# EAGLE design pc_max30003_brk_v2.0 (EAGLE 6.6.0)
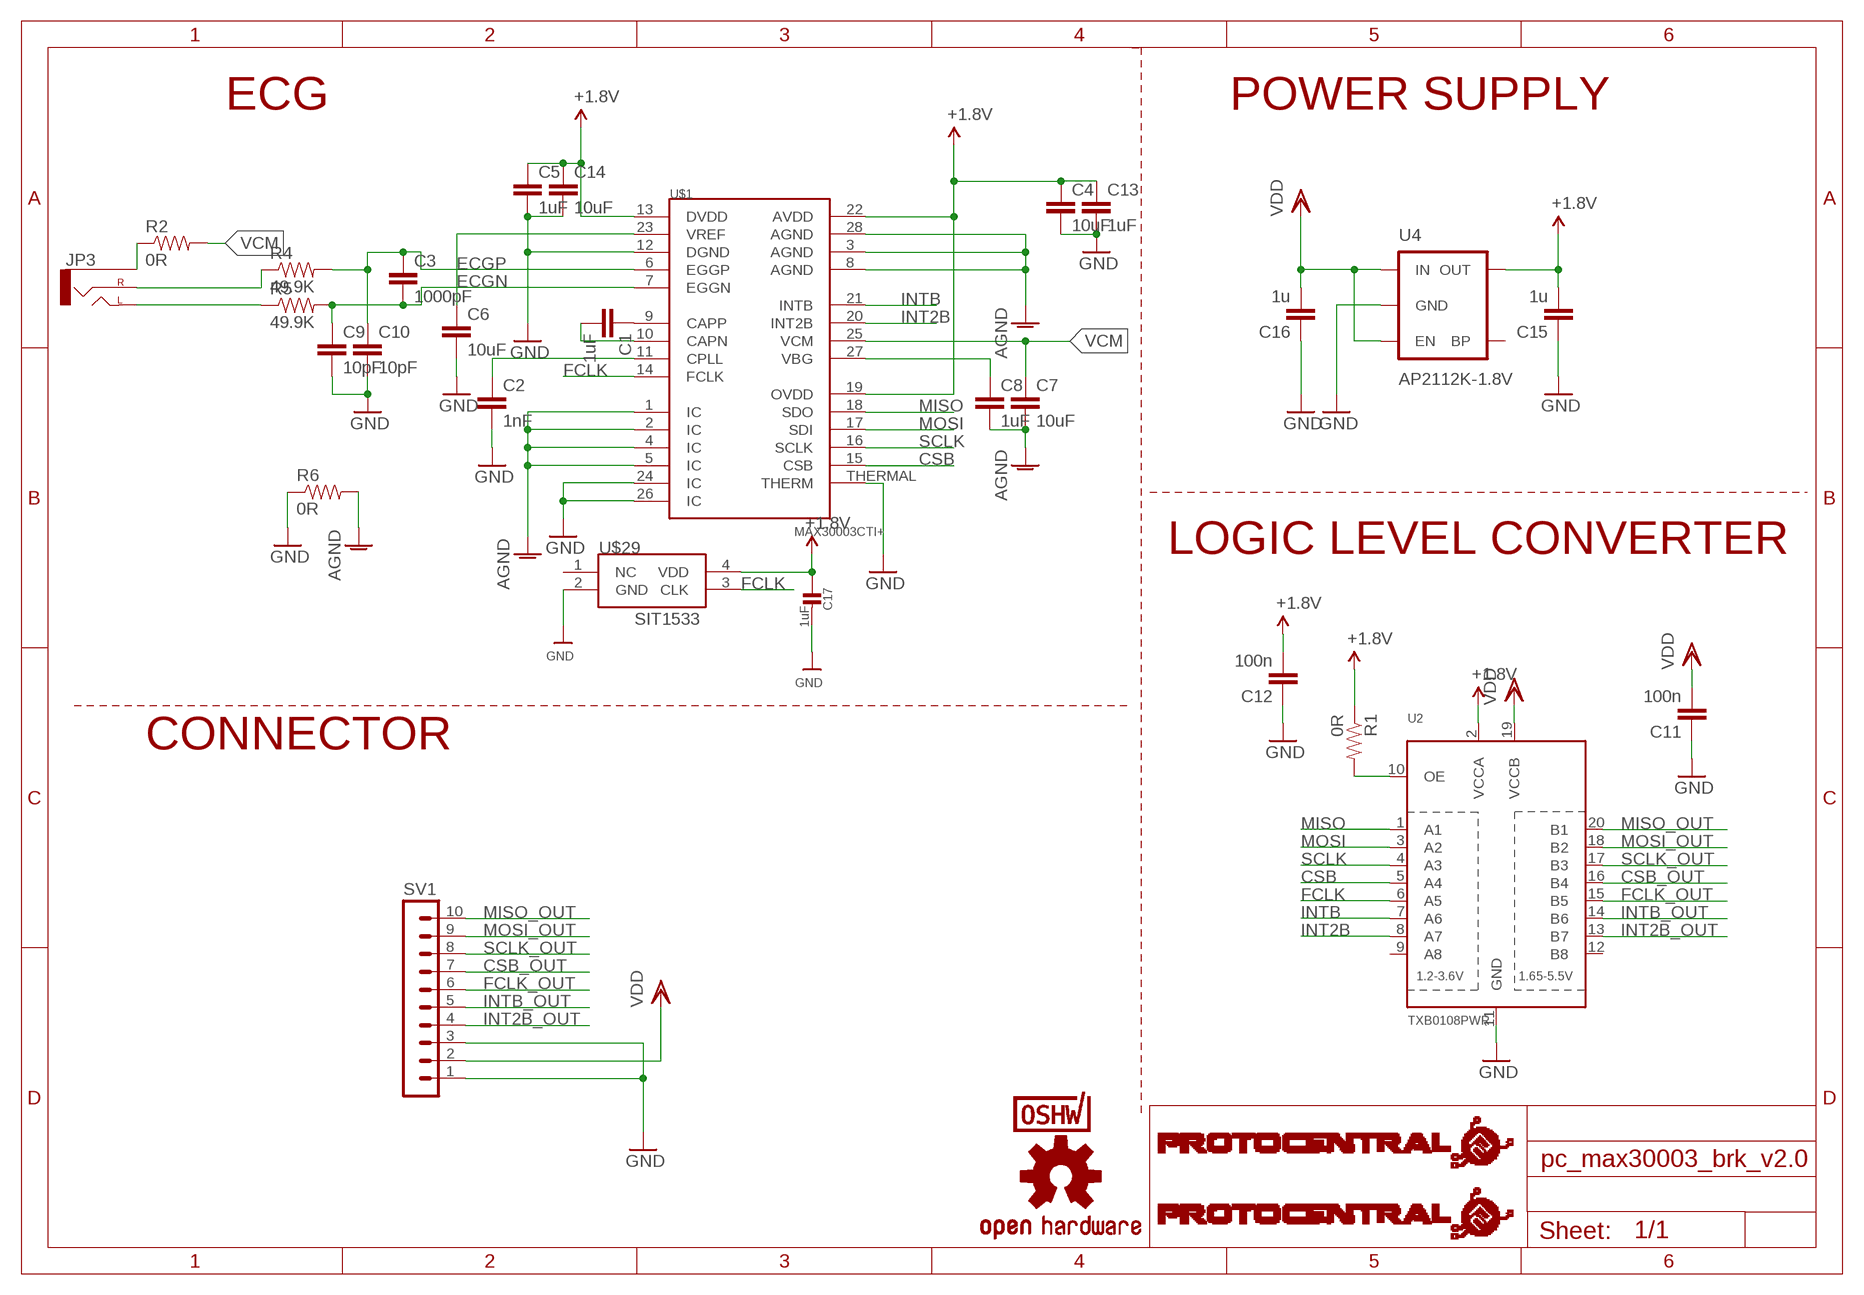
[diagram p0: schematic, sheet 1]

## Parts
C1  1uF  C-EUC0805  [C0805]
C2  1nF  C-EUC0805  [C0805]
C3  1000pF  C-EUC0402  [C0402]
C4  10uF  C-EUC0805  [C0805]
C5  1uF  C-EUC0805  [C0805]
C6  10uF  C-EUC0805  [C0805]
C7  10uF  C-EUC0805  [C0805]
C8  1uF  C-EUC0805  [C0805]
C9  10pF  C-EUC0402  [C0402]
C10  10pF  C-EUC0402  [C0402]
C11  100n  C-EUC0402  [C0402]
C12  100n  C-EUC0402  [C0402]
C13  1uF  C-EUC0805  [C0805]
C14  10uF  C-EUC0805  [C0805]
C15  1u  C-EUC0805  [C0805]
C16  1u  C-EUC0805  [C0805]
C17  1uF  CAP_CERAMIC_0402  [_0402]
JP3  AUDIO-JACKSMD2  [AUDIO-JACK-3.5MM-SMD]
R1  0R  RESISTOR0805-RES  [0805]
R2  0R  RESISTOR0805-RES  [0805]
R4  49.9K  RESISTOR0805-RES  [0805]
R5  49.9K  RESISTOR0805-RES  [0805]
R6  0R  RESISTOR0805-RES  [0805]
SV1  MA10-1  [MA10-1]
U2  TXB0108PWR  [TSSOP20]
U4  AP2112K-1.8V  V_REG_LDOSMD  [SOT23-5]
U$1  MAX30003CTI+  MAX30003  [QFN-28]
U$2  PROTY_LOGO_WITH_TEXT  [PROTY_WITH_TEXT]
U$3  PROTY-LOGO  [LOGO-PROTY]
U$6  OSHW-LOGOS  [OSHW-LOGO-S]
U$7  CERT-SMALL  [CERT-SMALL-SILK]
U$29  SIT1533  [SIT1533]

## Nets
+1.8V: C4.1 C5.1 C12.2 C13.1 C14.1 C15.2 C17.1 R1.1 U2.2(VCCA) U4.5(OUT) U$1.13(DVDD) U$1.19(OVDD) U$1.22(AVDD) U$29.4(VDD)
AGND: C7.2 C8.2 R6.2 U$1.1(IC) U$1.2(IC) U$1.3(AGND) U$1.4(IC) U$1.5(IC) U$1.8(AGND) U$1.28(AGND)
CSB: U2.5(A4) U$1.15(CSB)
CSB_OUT: SV1.7 U2.16(B4)
ECGN: C3.2 C9.1 R5.2 U$1.7(EGGN)
ECGP: C3.1 C10.1 R4.2 U$1.6(EGGP)
FCLK: U2.6(A5) U$1.14(FCLK) U$29.3(CLK)
FCLK_OUT: SV1.6 U2.15(B5)
GND: C2.2 C4.2 C5.2 C6.2 C9.2 C10.2 C11.1 C12.1 C13.2 C14.2 C15.1 C16.1 C17.2 R6.1 SV1.1 SV1.3 U2.11(GND) U4.2(GND) U$1.12(DGND) U$1.24(IC) U$1.26(IC) U$1.THERMAL(THERM) U$29.2(GND)
INT2B: U2.8(A7) U$1.20(INT2B)
INT2B_OUT: SV1.4 U2.13(B7)
INTB: U2.7(A6) U$1.21(INTB)
INTB_OUT: SV1.5 U2.14(B6)
MISO: U2.1(A1) U$1.18(SDO)
MISO_OUT: SV1.10 U2.20(B1)
MOSI: U2.3(A2) U$1.17(SDI)
MOSI_OUT: SV1.9 U2.18(B2)
N$1: R1.2 U2.10(OE)
N$2: C6.1 U$1.23(VREF)
N$3: C1.1 U$1.9(CAPP)
N$4: JP3.SLEEVE R2.1
N$6: C1.2 U$1.10(CAPN)
N$7: C2.1 U$1.11(CPLL)
N$9: JP3.TIP(LEFT) R5.1
N$10: JP3.RING(RIGHT) R4.1
N$14: C8.1 U$1.27(VBG)
SCLK: U2.4(A3) U$1.16(SCLK)
SCLK_OUT: SV1.8 U2.17(B3)
VCM: C7.1 R2.2 U$1.25(VCM)
VDD: C11.2 C16.2 SV1.2 U2.19(VCCB) U4.1(IN) U4.3(EN)
Unconnected: U2.9(A8) U2.12(B8) U4.4(BP) U$29.1(NC)

## Notes on the sheet
- ECG | POWER SUPPLY
- LOGIC LEVEL CONVERTER
- CONNECTOR

## Library data of the parts
C1-C16 = rcl:C-EU: CAPACITOR, European symbol
C17 = microbuilder:CAP_CERAMIC: Ceramic Capacitors For new designs, use the packages preceded by an '_' character since they are more reliable: The following footprints should be used on most boards: _0402 - Standard footprint for regular board layouts _0603 - Standard footprint for regular board layouts _0805 - Standard footprint for regular board layouts _1206 - Standard footprint for regular board layouts For extremely tight-pitch boards where space is at a premium, the following 'micro-pitch' footprints can be used (smaller pads, no silkscreen outline, etc.): _0402MP - Micro-pitch footprint for very dense/compact boards _0603MP - Micro-pitch footprint for very dense/compact boards _0805MP - Micro-pitch footprint for very dense/compact boards _1206MP - Micro-pitch footprint for very dense/compact boards
JP3 = SparkFun-Connectors:AUDIO-JACK: 3.5mm Audio Jack Simple 3.5mm common PCB mount audio jack. SKU: PRT-08032; PROD_ID: CONN-10353
R1 R2 R4-R6 = SparkFun:RESISTOR: Resistor Basic schematic elements and footprints for 0603, 1206, and PTH resistors.
SV1 = con-lstb:MA10-1: PIN HEADER; OC_FARNELL: unknown; OC_NEWARK: unknown
U2 = adafruit:TXB0108PWR: 8-Bit Bi-Directional Level Shifter 1.2V-3.6V (VCCA) to 1.65V-5.5V (VCCB) bi-directional level shifter with auto direction sensing. Max data rate - VCCA 1.8V: 20Mbps (50ns), VCCA 3.3V: 100Mbps (10ns) Digikey: 296-21527-1-ND
U4 = SparkFun-PowerIC:V_REG_LDO: Voltage Regulator LDO Standard 150mA LDO voltage regulator in SOT-23 layout. Micrel part MIC5205. BP (by-pass) pin is used to lower output noise with 470pF cap.; PROD_ID: VREG-12457
U$1 = circuitects:MAX30003
U$2 = circuitects:PROTY_LOGO_WITH_TEXT
U$3 = circuitects:PROTY-LOGO
U$6 = SparkFun:OSHW-LOGO: Open Source Hardware Logo This logo indicates the piece of hardware it is found on incorporates a OSHW license and/or adheres to the definition of open source hardware found here: http://freedomdefined.org/OSHW
U$7 = OSHWA:CERT
U$29 = circuitects:SIT1533

## Board
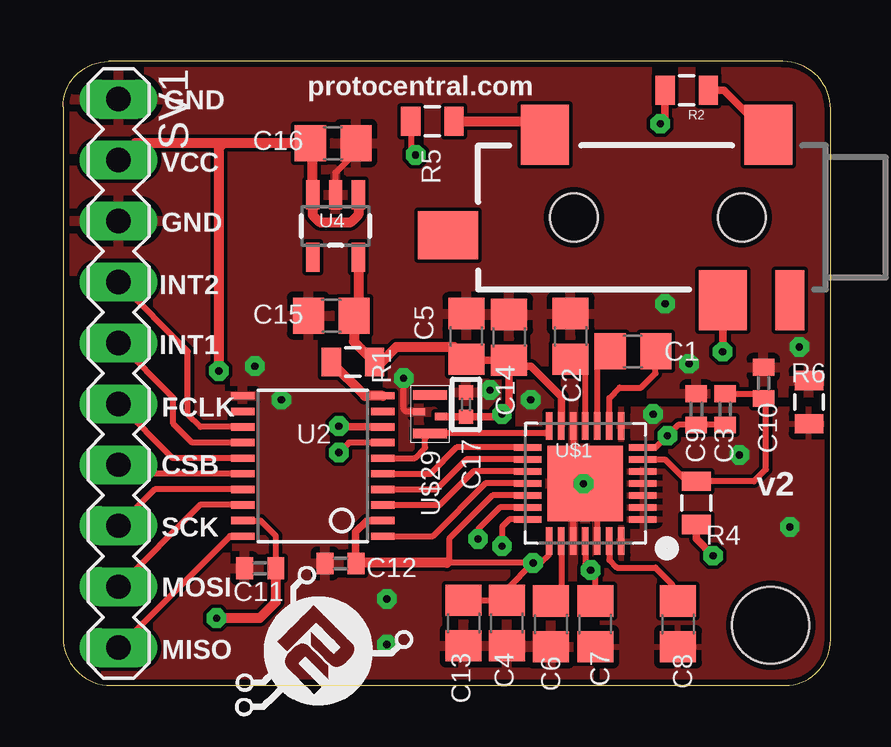
[diagram p1: board, top side]
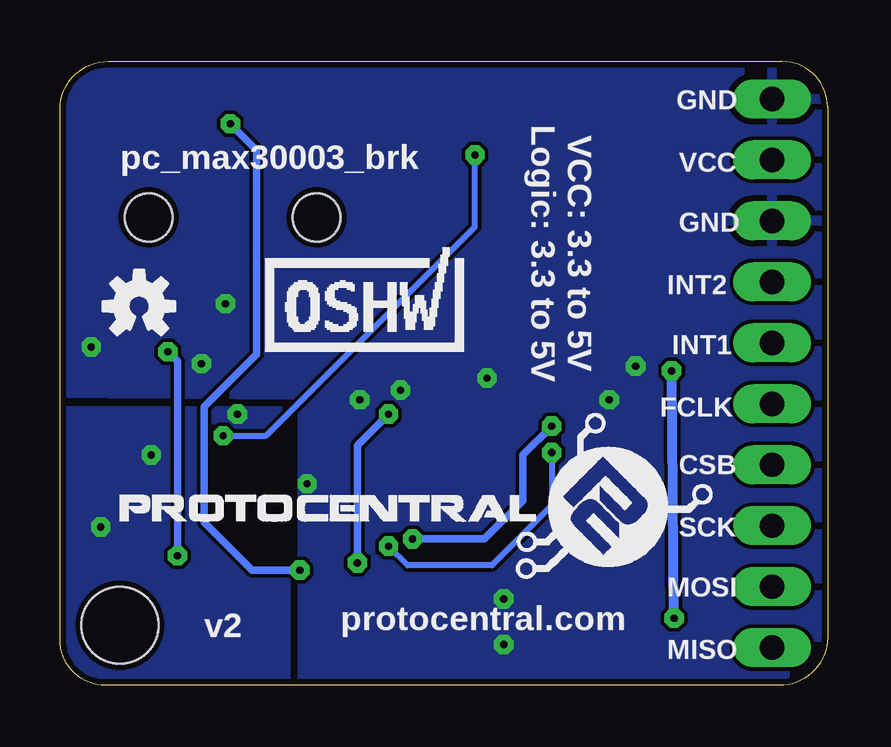
[diagram p2: board, bottom side, seen from below]

Size 32 x 26 mm. Coordinates in mm from the lower left corner, seen from the top.
Outline: 2,0 30.1,0 arc90 32,1.9 32,24 arc90 30,26 1.9,26 arc90 0,24.1 0,2 arc90 2,0
Copper layers (1*2*15*16): Top 0.035mm / dielectric 1.5mm / Route2 0.035mm / dielectric 0.15mm / Route15 0.035mm / dielectric 0.2mm / Bottom 0.035mm
Design rules "Circuitects-Rules": minimum track width 6mil, minimum drill 0.3mm, track to track 6mil, track to pad 6mil, pad to pad 6mil, via to via 6mil, smd to smd 6mil, copper to edge 10mil, drill to drill 8mil, minimum pad ring 12mil, minimum via ring 10mil, stop-mask expansion 4mil, vias tented up to drill 25mil, thermal gap 10mil
Holes 3.2 mm at 29.5,2.5

### Footprints (pad centres in the part's own frame; a part is rotated, then mirrored left to right if it is on the bottom)
C0805 = smd 1.3 x 1.5: 1 -0.95,0; 2 0.95,0
C0402 = smd 0.7 x 0.9: 1 -0.65,0; 2 0.65,0
_0402 = smd 0.6 x 0.6: 1 -0.508,0; 2 0.508,0
AUDIO-JACK-3.5MM-SMD = smd 2 x 2.5: RING 4.3,3.45; SLEEVE 2.4,-3.45; TIP 11.7,-3.45 | smd 1.2 x 2.5: RSH 1.5,3.45 | smd 2.5 x 2: TSH 15.75,0.75 | hole 2: 3.5,0; 10.5,0
0805 = smd 0.8 x 1.2: 1 -0.9,0; 2 0.9,0
MA10-1 = drill 1.016 long: 1 -11.43,0; 2 -8.89,0; 3 -6.35,0; 4 -3.81,0; 5 -1.27,0; 6 1.27,0; 7 3.81,0; 8 6.35,0; 9 8.89,0; 10 11.43,0
TSSOP20 = smd 0.305 x 0.991: 1 -2.925,-2.918; 2 -2.275,-2.918; 3 -1.625,-2.918; 4 -0.975,-2.918; 5 -0.325,-2.918; 6 0.325,-2.918; 7 0.975,-2.918; 8 1.625,-2.918; 9 2.275,-2.918; 10 2.925,-2.918; 11 2.925,2.918; 12 2.275,2.918; 13 1.625,2.918; 14 0.975,2.918; 15 0.325,2.918; 16 -0.325,2.918; 17 -0.975,2.918; 18 -1.625,2.918; 19 -2.275,2.918; 20 -2.925,2.918
SOT23-5 = smd 0.55 x 1.2: 1 -0.95,-1.3; 2 0,-1.3; 3 0.95,-1.3; 4 0.95,1.3; 5 -0.95,1.3
QFN-28 = smd 1.15 x 0.27: 1 -2.4,1.5; 2 -2.4,1; 3 -2.4,0.5; 4 -2.4,0; 5 -2.4,-0.5; 6 -2.4,-1; 7 -2.4,-1.5; 15 2.4,-1.5; 16 2.4,-1; 17 2.4,-0.5; 18 2.4,0; 19 2.4,0.5; 20 2.4,1; 21 2.4,1.5 | smd 0.27 x 1.15: 8 -1.5,-2.4; 9 -1,-2.4; 10 -0.5,-2.4; 11 0,-2.4; 12 0.5,-2.4; 13 1,-2.4; 14 1.5,-2.4; 22 1.5,2.4; 23 1,2.4; 24 0.5,2.4; 25 0,2.4; 26 -0.5,2.4; 27 -1,2.4; 28 -1.5,2.4 | smd 3.15 x 3.15: THERMAL 0,0
SIT1533 = smd 0.4 x 1.4: 1 -0.8,0; 3 0.8,0 | smd 0.3 x 0.5: 2 -0.1,-0.45; 4 0.1,0.45

### Placement (x,y rotation side)
C1  23.76,13.91 180 top
C2  21.16,14.54 90 top
C3  27.6,11.5 270 top
C4  18.5,2.6 270 top
C5  16.81,14.54 90 top
C6  20.34,2.56 270 top
C7  22.19,2.56 270 top
C8  25.64,2.56 270 top
C9  26.4,11.5 90 top
C10  29.2,12.6 90 top
C11  8.22,4.88 0 top
C12  11.57,5.08 0 top
C13  16.7,2.6 270 top
C14  18.6,14.5 90 top
C15  11.18,15.4 0 top
C16  11.26,22.59 180 top
C17  16.8,11.7 90 top
JP3  31.8,19.5 180 top
R1  12.08,13.47 180 top
R2  26,24.8 180 top
R4  26.4,7.6 90 top
R5  15.4,23.5 180 top
R6  31.1,11.8 270 top
SV1  2.31,13 270 top
U2  10.41,9.14 90 top
U4  11.36,19.14 180 top
U$1  21.77,8.41 180 top
U$2  29.5,4.8 0 bottom
U$3  7.1,-1.4 0 top
U$6  28.7,15.8 0 bottom
U$7  19.3,13.9 0 bottom
U$29  15.3,11.3 270 top

### Tracks (layer width: path | path; a pad name or v marks a point on that pad's centre or on a via)
+1.8V  (via drill 0.3)
  Top 0.254: U$1.19 17.91,7.91 16.1,6.1 16.1,5.2 16,5.1 v19.6,5.1 | U$1.22 20.27,5.47 19.9,5.1 v19.6,5.1 | v19.6,5.1 18.5,4 C4.1 C13.1
  Top 0.305: U2.2 12.66,6.87 12.2,6.4 12.2,5.1 C12.2 | U$1.13 20.77,12.03 19.5,13.3 18.85,13.3 C14.1 | C14.1 16.85,13.55 C5.1 | U$29.4 16.99,11.2 C17.1 18.19,11.19 v18.3,11.3 18.6,11.6 C14.1
  Top 0.406: 16,5.1 12.24,5.1 C12.2 | C5.1 16.3,14.1 13.9,14.1 13.27,13.47 R1.1 12.13,14.32 C15.2 12.31,15.58 U4.5
  Bottom 0.305: v19.6,5.1 19.6,10 v18.3,11.3
AGND  (via drill 0.3)
  other vias: 30.3,6.6 24.6,11.3 28.2,9.6
  pour Bottom: 22.5,11.5 32.6,11.5 32.6,-0.1 22.5,-0.1
  pour Top: 22.5,11.5 32.6,11.5 32.6,-0.1 22.5,-0.1
CSB
  Top 0.254: U$1.15 16.41,9.91 15.31,8.81 U2.5
CSB_OUT
  Top 0.254: U2.16 2.69,8.81 SV1.7
ECGN  (via drill 0.3)
  Top 0.254: C3.2 C9.1 25.65,10.85 v25.2,10.4 24.71,9.91 U$1.7 | R5.2 14.5,22.3 v14.7,22.1
  Bottom 0.254: v25.2,10.4 23.4,10.4 14.7,19.1 v14.7,22.1
ECGP
  Top 0.254: U$1.6 25.09,9.41 26,8.5 R4.2 28.8,8.5 29.3,9 29.3,11.85 C10.1 29,12.15 C3.1
FCLK
  Top 0.254: U$1.14 20.27,10.67 20.1,10.5 U$29.3 15.1,10.3 15.1,9.9 14.66,9.46 U2.6
FCLK_OUT
  Top 0.254: U2.15 4.58,9.46 SV1.6
GND  (via drill 0.3)
  Top 0.254: U4.2 11.36,21.36 12.21,22.21 C16.1 | U$1.12 21.27,8.83 v21.7,8.4 21.27,7.97 U$1.24 | U$29.2 14.3,11.4 14.2,11.5 v14.2,12.8 | U$1.26 22.27,7.91 U$1.THERMAL
  other vias: 8,13.3 13.5,1.7 13.5,3.6 9.1,11.9 25.1,15.9 26.1,13.4 30.7,14.1 19.5,11.9 17.8,12.3
  pour Top: 0,26.2 32.7,26.2 32.7,12.2 21.9,12.1 21.9,0 0,0.2
  pour Bottom: -0.1,26.2 32.7,26.2 32.7,12.2 21.9,12.1 21.9,0.1 -0.1,0.3
INT2B  (via drill 0.3)
  Top 0.254: U$1.20 18.21,7.41 17.3,6.5 v17.3,6.1
  Top 0.305: U2.8 11.54,10.77 v11.5,10.8
  Bottom 0.305: v17.3,6.1 14.3,6.1 12.7,7.7 12.7,9.6 v11.5,10.8
INT2B_OUT
  Top 0.254: U2.13 5.74,10.77 5.2,11.3 5.2,13.92 SV1.4
INTB  (via drill 0.3)
  Top 0.254: U$1.21 18.61,6.91 18.3,6.6 v18.3,5.8 | U2.7 11.91,10.12 v11.5,9.7
  Bottom 0.254: v11.5,9.7 11.5,7.5 14,5 17.5,5 v18.3,5.8
INTB_OUT
  Top 0.254: U2.14 5.38,10.12 4.6,10.9 4.6,11.98 SV1.5
MISO
  Top 0.254: U$1.18 17.61,8.41 15.41,6.21 U2.1
MISO_OUT
  Top 0.254: U2.20 6.96,6.21 SV1.10
MOSI
  Top 0.254: U$1.17 17.11,8.91 15.71,7.51 U2.3
MOSI_OUT
  Top 0.254: U2.18 5.71,7.51 SV1.9
N$1
  Top 0.406: U2.10 12.59,12.06 R1.2
N$2
  Top 0.254: U$1.23 20.77,3.94 C6.1
N$3
  Top 0.254: U$1.9 22.77,11.97 23.2,12.4 24.1,12.4 24.7,13 C1.1
N$4
  Top 0.305: R2.1 27.55,24.8 JP3.SLEEVE
N$6
  Top 0.254: U$1.10 22.27,13.37 C1.2
N$7
  Top 0.254: U$1.11 21.77,12.98 C2.1
N$9
  Top 0.406: R5.1 19.55,23.5 JP3.TIP
N$10  (via drill 0.3)
  Top 0.305: R4.1 26.4,6.1 v27.1,5.4 | JP3.RING v27.5,13.9
  Bottom 0.305: v27.1,5.4 27.1,13.5 v27.5,13.9
N$14
  Top 0.254: U$1.27 22.77,5.23 23.1,4.9 24.7,4.9 25.4,4.2 25.4,3.75 C8.1
SCLK
  Top 0.254: U$1.16 16.81,9.41 15.56,8.16 U2.4
SCLK_OUT
  Top 0.254: U2.17 3.83,8.16 SV1.8
VCM  (via drill 0.3)
  Top 0.254: U$1.25 21.77,5.03 v22,4.8 22.19,4.61 C7.1
  Top 0.305: R2.2 25.1,23.6 v24.9,23.4
  Bottom 0.305: v22,4.8 24,4.8 26,6.8 26,11.6 23.8,13.8 23.8,22.3 v24.9,23.4
VDD  (via drill 0.3)
  Top 0.254: U2.19 8.23,6.87 8.87,6.23 C11.2
  Top 0.406: U4.1 12.31,19.61 12,19.3 10.7,19.3 10.41,19.59 U4.3 10.41,22.49 C16.2 6.7,22.59 | 6.7,22.59 3.01,22.59 SV1.2 | v6.5,13.1 6.5,22.39 6.7,22.59 | C11.2 8.87,3.47 8.2,2.8 v6.4,2.8
  Bottom 0.406: v6.4,2.8 v6.5,13.1

### Text on the board
tPlace: protocentral.com | GND | VCC | GND | INT2 | INT1 | FCLK | CSB | v2 | SCK | MOSI | MISO
bPlace: GND | pc_max30003_brk | VCC | GND | VCC: 3.3 to 5V / Logic: 3.3 to 5V | INT2 | INT1 | FCLK | CSB | SCK | MOSI | protocentral.com | v2 | MISO